# Altium schematic sheet power.SCHDOC
size B
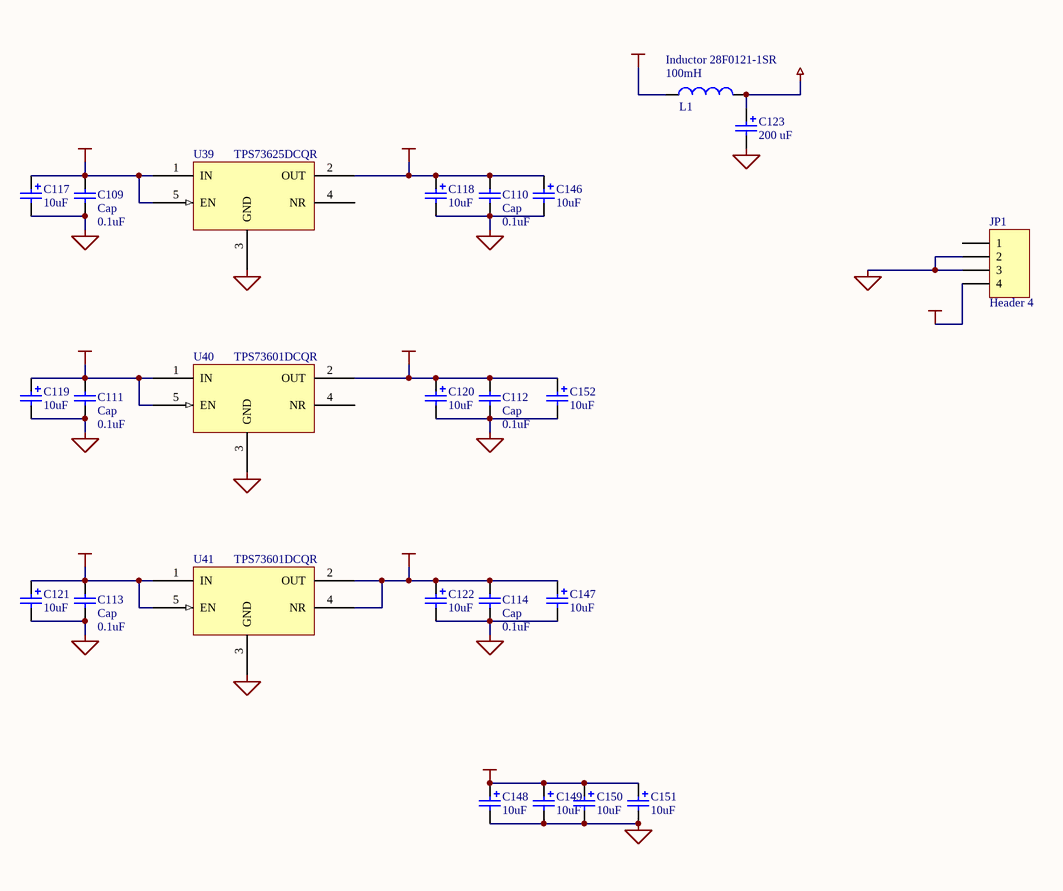
[diagram p0: power.SCHDOC]

## Parts
C109  Cap  value 0.1uF  [CC1608-0603]
C110  Cap  value 0.1uF  [CC1608-0603]
C111  Cap  value 0.1uF  [CC1608-0603]
C112  Cap  value 0.1uF  [CC1608-0603]
C113  Cap  value 0.1uF  [CC1608-0603]
C114  Cap  value 0.1uF  [CC1608-0603]
C117  value 10uF  [TC7343-2917]  (hidden comment: Cap Pol1)
C118  value 10uF  [TC7343-2917]  (hidden comment: Cap Pol1)
C119  value 10uF  [TC7343-2917]  (hidden comment: Cap Pol1)
C120  value 10uF  [TC7343-2917]  (hidden comment: Cap Pol1)
C121  value 10uF  [TC7343-2917]  (hidden comment: Cap Pol1)
C122  value 10uF  [TC7343-2917]  (hidden comment: Cap Pol1)
C123  value 200 uF  [PanasonicE]
C146  value 10uF  [TC7343-2917]  (hidden comment: Cap Pol1)
C147  value 10uF  [TC7343-2917]  (hidden comment: Cap Pol1)
C148  value 10uF  [TC7343-2917]  (hidden comment: Cap Pol1)
C149  value 10uF  [TC7343-2917]  (hidden comment: Cap Pol1)
C150  value 10uF  [TC7343-2917]  (hidden comment: Cap Pol1)
C151  value 10uF  [TC7343-2917]  (hidden comment: Cap Pol1)
C152  value 10uF  [TC7343-2917]  (hidden comment: Cap Pol1)
JP1  Header 4  [PCHW-molex]
L1  Inductor 28F0121-1SR  value 100mH  [STEWARD_1SR]
U39  TPS73625DCQR  [SOT223-5/Simple]
U40  TPS73601DCQR  [SOT223-5/Simple]
U41  TPS73601DCQR  [SOT223-5/Simple]

## Nets
+1.2VCC: C114.2 C122.1 C147.1 U41.2(OUT) U41.4(NR)
+1.2VCCUSB: C112.2 C120.1 C152.1 U40.2(OUT)
+2.5VCC: C110.2 C118.1 C146.1 U39.2(OUT)
+5VCC: JP1.4 L1.1
AVDD: C123.1 L1.2
GND: C109.1 C110.1 C111.1 C112.1 C113.1 C114.1 C117.2 C118.2 C119.2 C120.2 C121.2 C122.2 C123.2 C146.2 C147.2 C148.2 C149.2 C150.2 C151.2 C152.2 JP1.2 JP1.3 U39.3(GND) U40.3(GND) U41.3(GND)
VCC: C109.2 C111.2 C113.2 C117.1 C119.1 C121.1 C148.1 C149.1 C150.1 C151.1 U39.1(IN) U39.5(EN) U40.1(IN) U40.5(EN) U41.1(IN) U41.5(EN)

Not connected (* = marked no-connect by the designer): JP1 1; U39 4(NR); U40 4(NR)

## Library data of the parts
C109-C114 = Cap: Capacitor; Manufacturer: Generic Components; Class I: Passive; Published: 8-Jun-2000; Revision: July-2002: Re-released for DXP Platform.; Publisher: Altium Limited; Class II: Capacitor
C117-C122 C146-C152 = Cap Pol1: Polarized Capacitor (Radial); Manufacturer: Generic Components; Class I: Passive; Published: 8-Jun-2000; Revision: July-2002: Re-released for DXP Platform.; Publisher: Altium Limited; Class II: Capacitor
C123 = Cap Pol3: Polarized Capacitor (Surface Mount); Manufacturer: Generic Components; Class I: Passive; Published: 8-Jun-2000; Revision: July-2002: Re-released for DXP Platform.; Publisher: Altium Limited; Class II: Capacitor
JP1 = Header 4: Header, 4-Pin; Manufacturer: Generic Components; Class I: Connector; Revision: July-2002: Re-released for DXP Platform.; Publisher: Altium Limited
L1 = Inductor: Manufacturer: Generic Components; Class I: Passive; Published: 8-Jun-2000; Revision: July-2002: Re-released for DXP Platform.; Publisher: Altium Limited; Class II: Inductor
U39-U41 = TPS736XX: Cap-free NMOS 400 mA LDO